# Altium schematic sheet BLOCK2.SchDoc
size A4; SheetNumber: 5; SheetTotal: 5
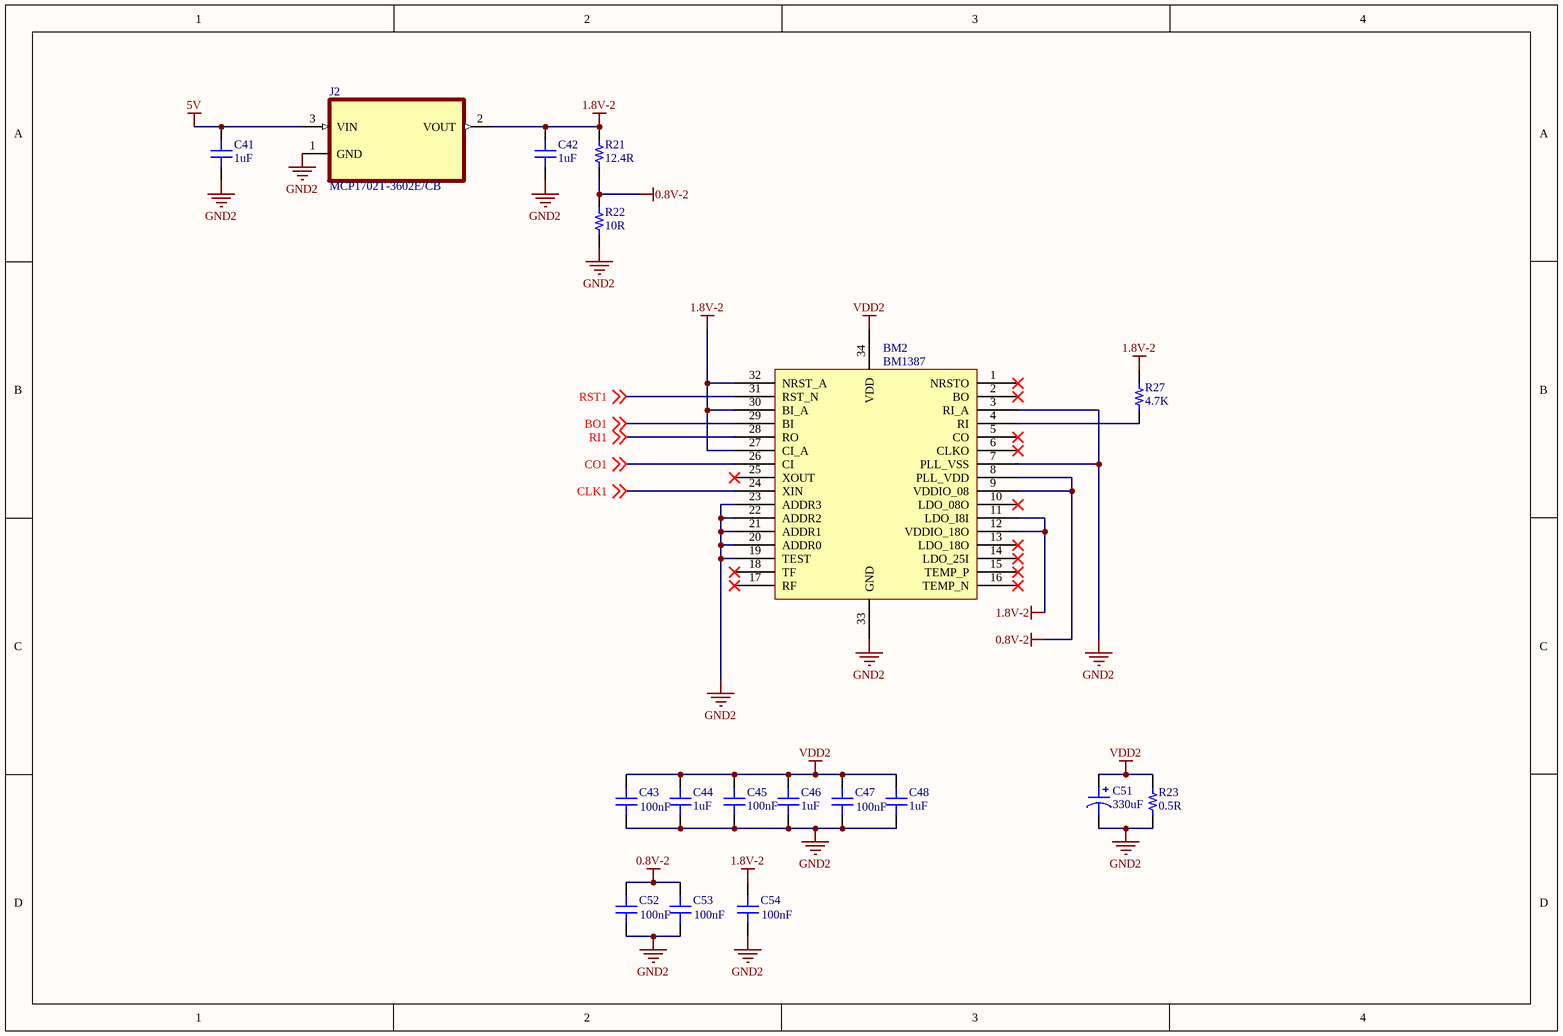
[diagram p0: BLOCK2.SchDoc]

## Parts
BM2  BM1387  [BM1387]
C41  1uF  [CAP-SMD-0402]
C42  1uF  [CAP-SMD-0402]
C43  100nF  [CAP_SMD_1206]
C44  1uF  [CAP_SMD_1206]
C45  100nF  [CAP_SMD_1206]
C46  1uF  [CAP_SMD_1206]
C47  100nF  [CAP_SMD_1206]
C48  1uF  [CAP_SMD_1206]
C51  330uF  [CAP-TAN-CASE-E]
C52  100nF  [CAP-SMD-0402]
C53  100nF  [CAP-SMD-0402]
C54  100nF  [CAP-SMD-0402]
J2  MCP1702T-3602E/CB  [SOT95P255X145-3N]
R21  12.4R  [RES-SMD-0402]
R22  10R  [RES-SMD-0402]
R23  0.5R  [RES-SMD-1206]
R27  4.7K  [RES-SMD-0402]

## Nets
0.8V-2: BM2.8(PLL_VDD) BM2.9(VDDIO_08) C52.2 C53.2 R21.1 R22.2
1.8V-2: BM2.11(LDO_I8I) BM2.12(VDDIO_18O) BM2.27(CI_A) BM2.30(BI_A) BM2.32(NRST_A) C42.2 C54.2 J2.2(VOUT) R21.2 R27.2
5V: C41.2 J2.3(VIN)
GND2: BM2.3(RI_A) BM2.7(PLL_VSS) BM2.19(TEST) BM2.20(ADDR0) BM2.21(ADDR1) BM2.22(ADDR2) BM2.23(ADDR3) BM2.33(GND) C41.1 C42.1 C43.1 C44.1 C45.1 C46.1 C47.1 C48.1 C51.2 C52.1 C53.1 C54.1 J2.1(GND) R22.1 R23.1
VDD2: BM2.34(VDD) C43.2 C44.2 C45.2 C46.2 C47.2 C48.2 C51.1 R23.2
BO1: BM2.29(BI) ; off-sheet BO1
CLK1: BM2.24(XIN) ; off-sheet CLK1
CO1: BM2.26(CI) ; off-sheet CO1
RI1: BM2.28(RO) ; off-sheet RI1
RST1: BM2.31(RST_N) ; off-sheet RST1
NetBM2_4: BM2.4(RI) R27.1

Not connected (* = marked no-connect by the designer): BM2 1(NRSTO)* 2(BO)* 5(CO)* 6(CLKO)* 10(LDO_08O)* 13(LDO_18O)* 14(LDO_25I)* 15(TEMP_P)* 16(TEMP_N)* 17(RF)* 18(TF)* 25(XOUT)*

## Library data of the parts
C41-C48 C52-C54 = CAP
C51 = POLARIZED CAP
J2 = MCP1702T-3602E/CB: 250 mA Low Quiescent Current LDO Regulator; Package: None; Price: None; Value: *; MP: MCP1702T-3602E/CB; Availability: Unavailable
R21-R23 R27 = RES